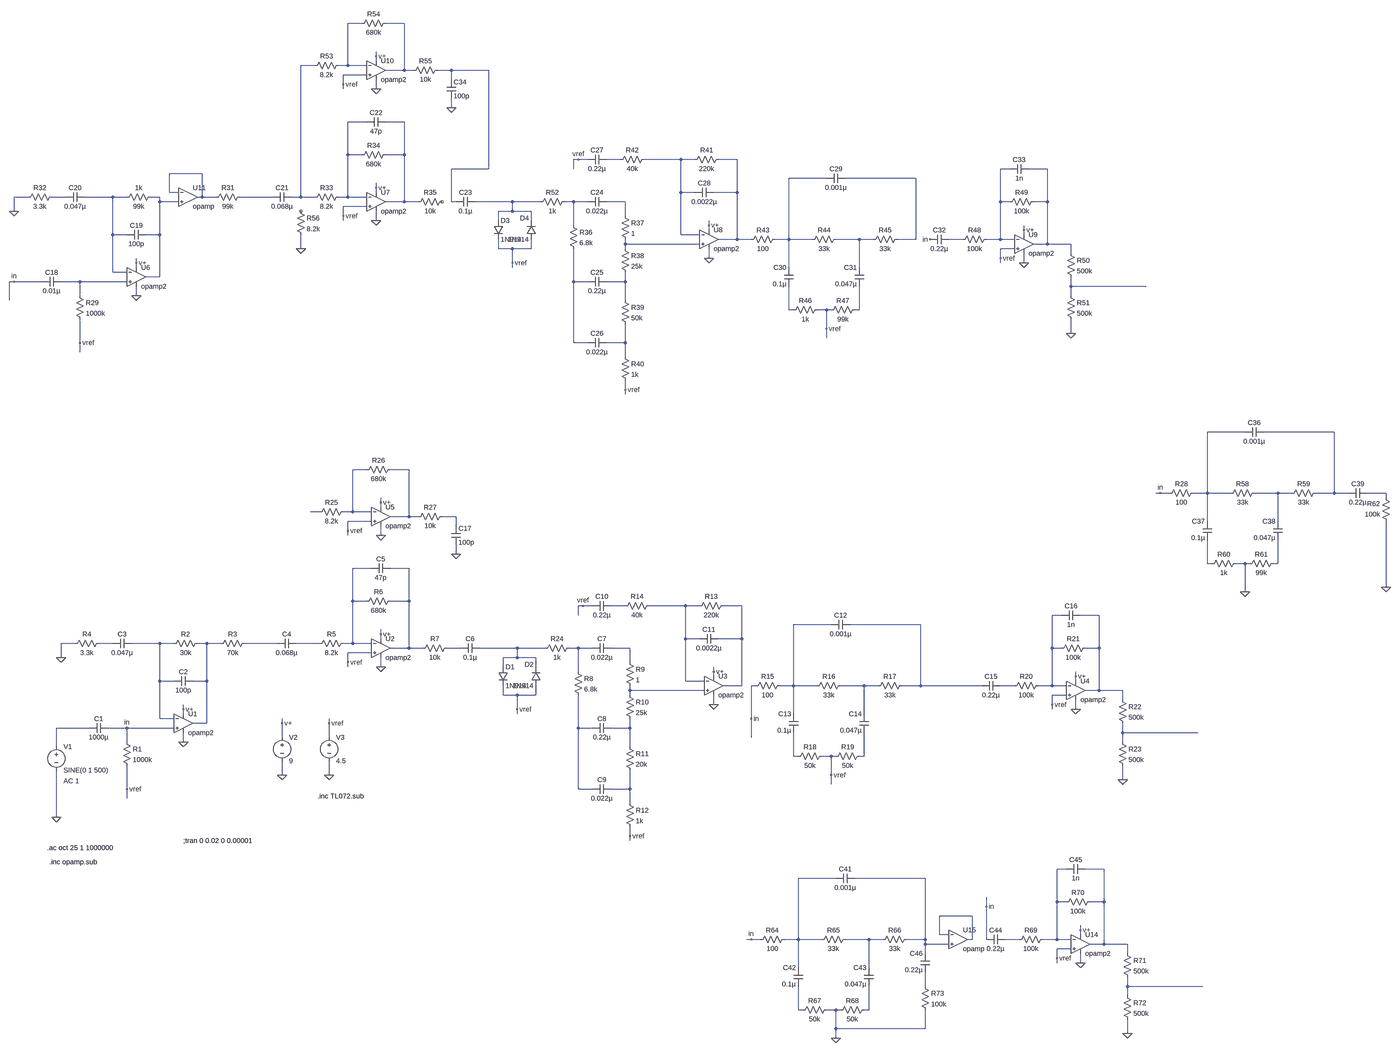
[diagram p0: schematic sMaster.asc, whole sheet]
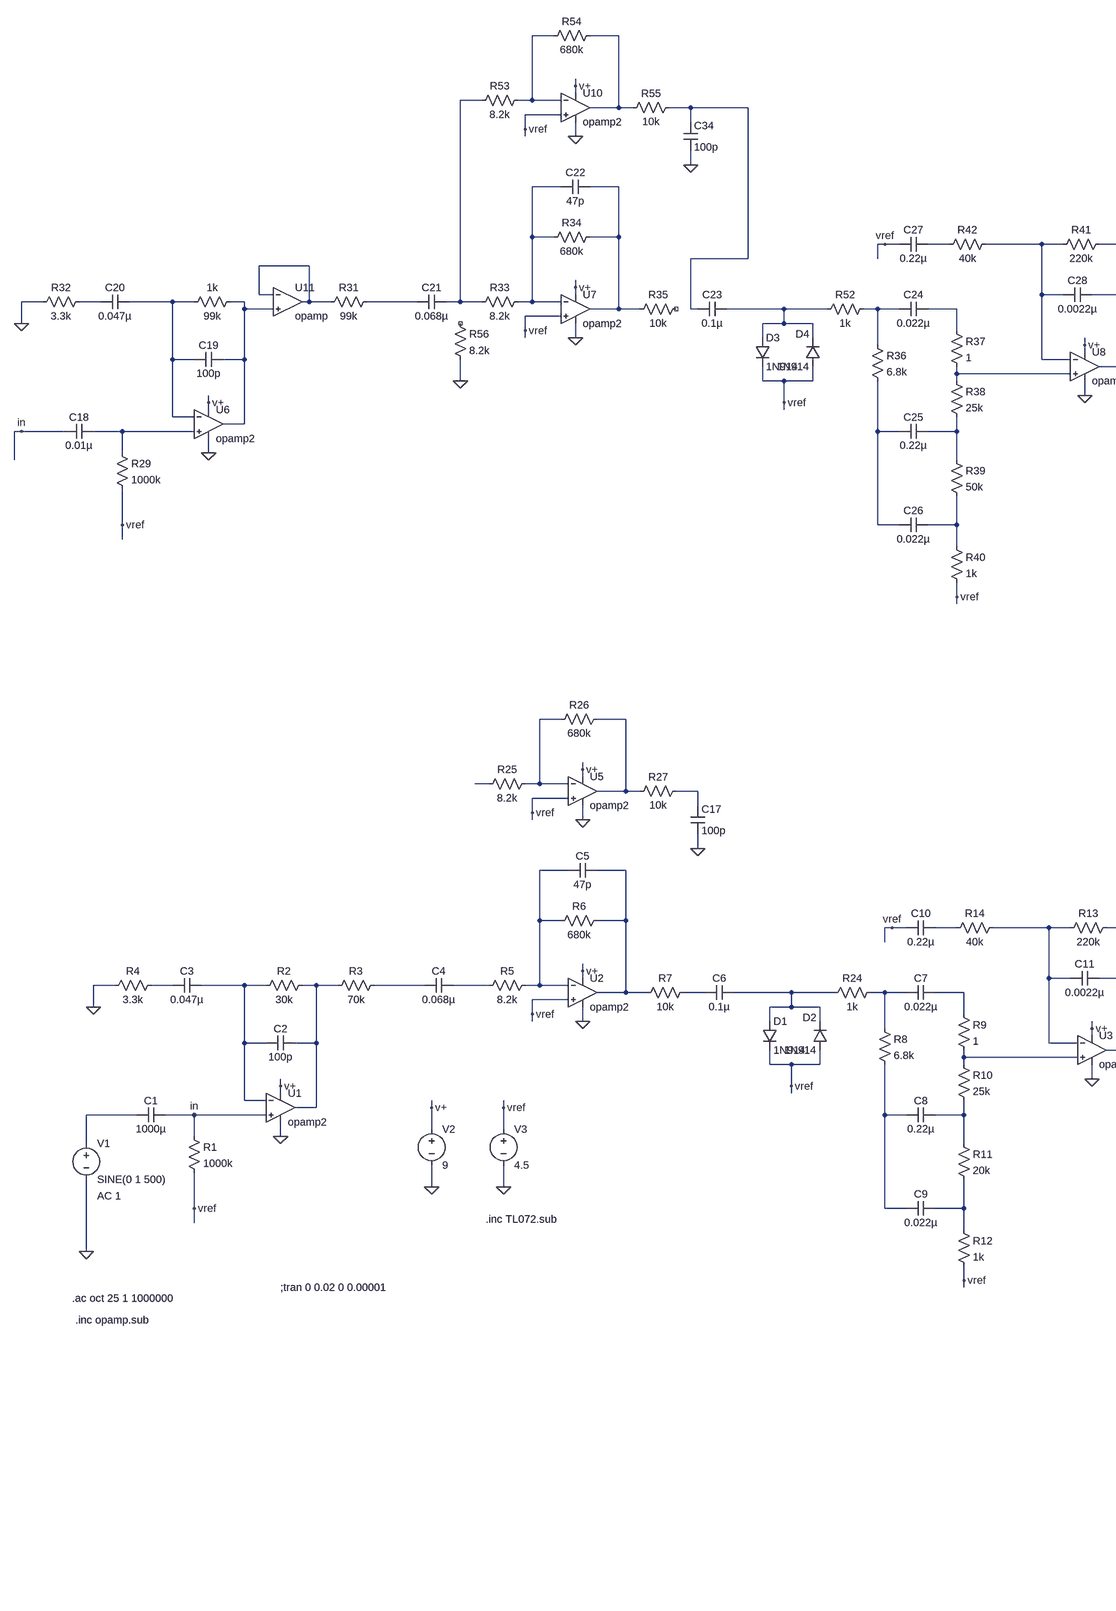
[diagram p1: schematic sMaster.asc, part, row 1 of 1, column 1 of 2]
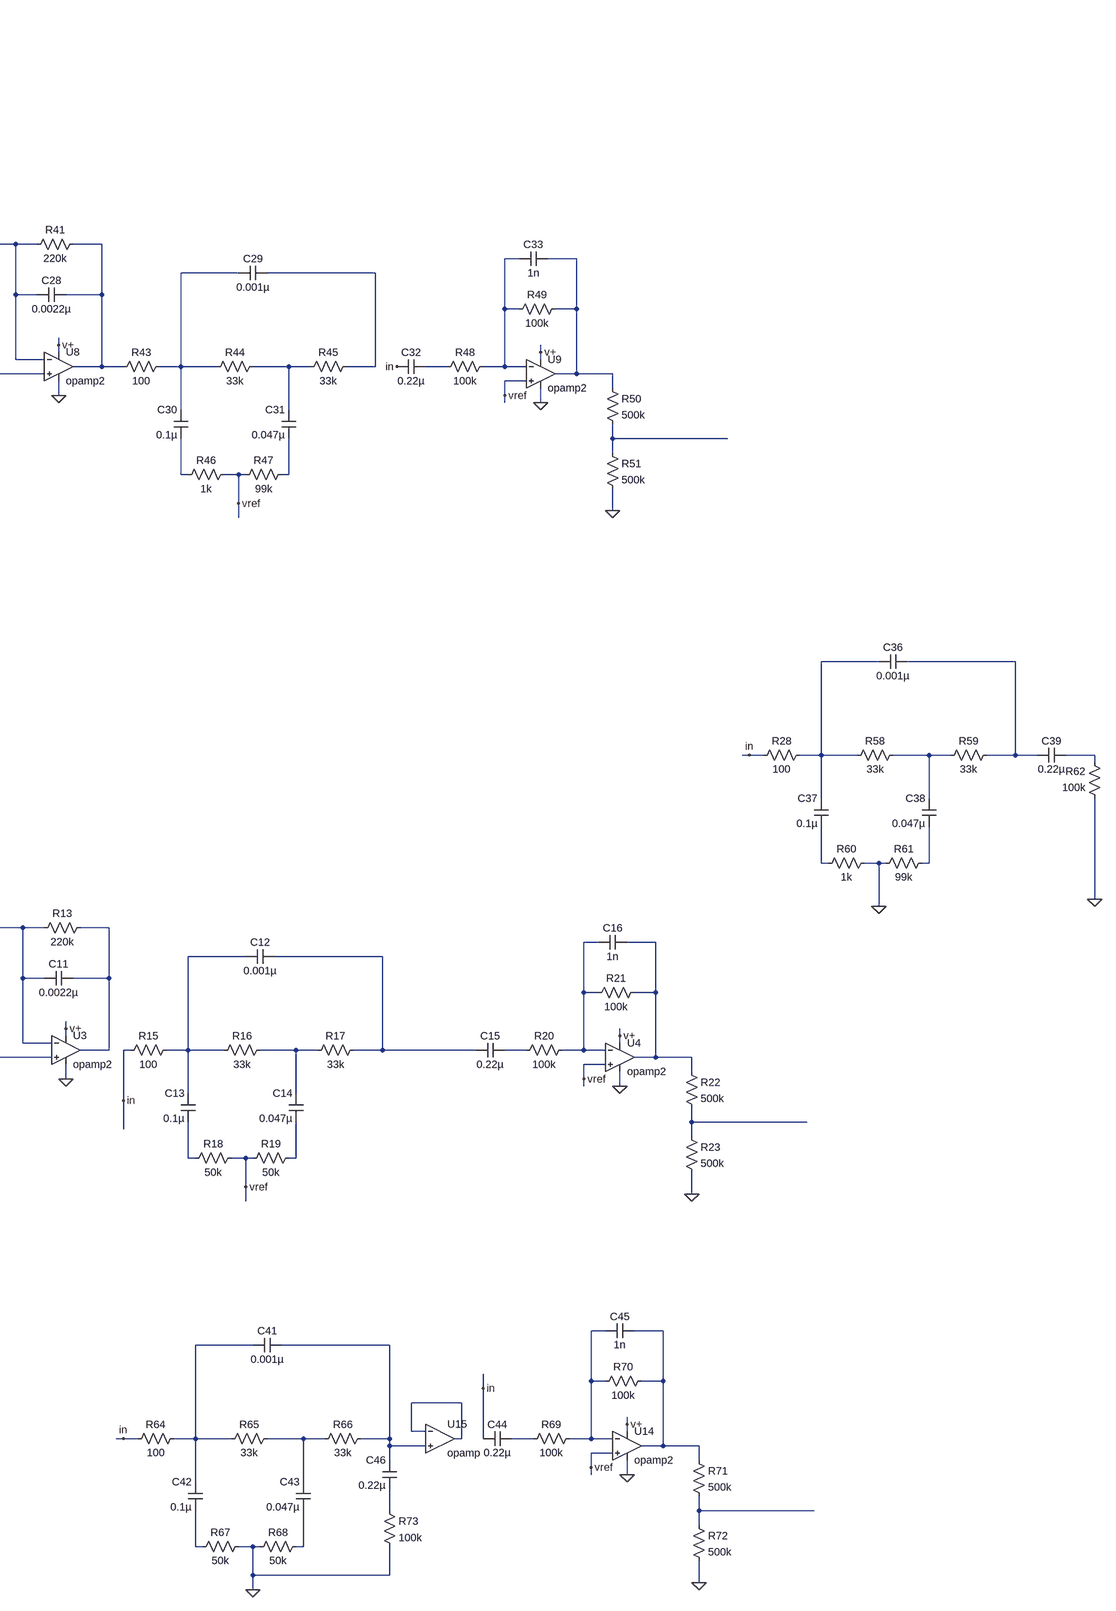
[diagram p2: schematic sMaster.asc, part, row 1 of 1, column 2 of 2]
sMaster.asc, the LTspice schematic file:
Version 4
SHEET 1 4708 1172
WIRE 1104 -2304 1056 -2304
WIRE 1248 -2304 1184 -2304
WIRE 1152 -2192 1152 -2208
WIRE 1152 -2176 1152 -2192
WIRE 944 -2160 896 -2160
WIRE 1056 -2160 1056 -2304
WIRE 1056 -2160 1024 -2160
WIRE 1120 -2160 1056 -2160
WIRE 1248 -2144 1248 -2304
WIRE 1248 -2144 1184 -2144
WIRE 1280 -2144 1248 -2144
WIRE 1408 -2144 1360 -2144
WIRE 1536 -2144 1408 -2144
WIRE 1120 -2128 1040 -2128
WIRE 1408 -2112 1408 -2144
WIRE 1040 -2096 1040 -2128
WIRE 1040 -2080 1040 -2096
WIRE 1152 -2080 1152 -2112
WIRE 1408 -2016 1408 -2048
WIRE 1120 -1968 1056 -1968
WIRE 1248 -1968 1184 -1968
WIRE 1056 -1856 1056 -1968
WIRE 1104 -1856 1056 -1856
WIRE 1248 -1856 1248 -1968
WIRE 1248 -1856 1184 -1856
WIRE 1840 -1840 1824 -1840
WIRE 1872 -1840 1840 -1840
WIRE 1984 -1840 1936 -1840
WIRE 2192 -1840 2064 -1840
WIRE 2240 -1840 2192 -1840
WIRE 2384 -1840 2320 -1840
WIRE 1536 -1808 1536 -2144
WIRE 1536 -1808 1408 -1808
WIRE 1824 -1808 1824 -1840
WIRE 3312 -1808 3280 -1808
WIRE 3440 -1808 3376 -1808
WIRE 560 -1792 448 -1792
WIRE 2688 -1776 2560 -1776
WIRE 2992 -1776 2752 -1776
WIRE 1152 -1744 1152 -1760
WIRE 448 -1728 448 -1792
WIRE 480 -1728 448 -1728
WIRE 1152 -1728 1152 -1744
WIRE 2192 -1728 2192 -1840
WIRE 2240 -1728 2192 -1728
WIRE 2384 -1728 2384 -1840
WIRE 2384 -1728 2304 -1728
WIRE -32 -1712 -80 -1712
WIRE 96 -1712 48 -1712
WIRE 256 -1712 160 -1712
WIRE 304 -1712 256 -1712
WIRE 416 -1712 384 -1712
WIRE 560 -1712 560 -1792
WIRE 560 -1712 544 -1712
WIRE 608 -1712 560 -1712
WIRE 800 -1712 688 -1712
WIRE 896 -1712 896 -2160
WIRE 896 -1712 864 -1712
WIRE 944 -1712 896 -1712
WIRE 1056 -1712 1056 -1856
WIRE 1056 -1712 1024 -1712
WIRE 1120 -1712 1056 -1712
WIRE 416 -1696 416 -1712
WIRE 480 -1696 416 -1696
WIRE 1248 -1696 1248 -1856
WIRE 1248 -1696 1184 -1696
WIRE 1296 -1696 1248 -1696
WIRE 1408 -1696 1408 -1808
WIRE 1424 -1696 1408 -1696
WIRE 1616 -1696 1488 -1696
WIRE 1712 -1696 1616 -1696
WIRE 1824 -1696 1792 -1696
WIRE 1872 -1696 1824 -1696
WIRE 2000 -1696 1936 -1696
WIRE 3280 -1696 3280 -1808
WIRE 3312 -1696 3280 -1696
WIRE 3440 -1696 3440 -1808
WIRE 3440 -1696 3392 -1696
WIRE 1120 -1680 1040 -1680
WIRE -80 -1664 -80 -1712
WIRE 1616 -1664 1616 -1696
WIRE 1616 -1664 1568 -1664
WIRE 1680 -1664 1616 -1664
WIRE 1040 -1648 1040 -1680
WIRE 2000 -1648 2000 -1696
WIRE 1040 -1632 1040 -1648
WIRE 1152 -1632 1152 -1664
WIRE 1568 -1632 1568 -1664
WIRE 1680 -1632 1680 -1664
WIRE 1824 -1616 1824 -1696
WIRE 2288 -1616 2288 -1632
WIRE 2288 -1600 2288 -1616
WIRE 3360 -1600 3360 -1616
WIRE 256 -1584 256 -1712
WIRE 304 -1584 256 -1584
WIRE 416 -1584 416 -1696
WIRE 416 -1584 368 -1584
WIRE 2192 -1584 2192 -1728
WIRE 2256 -1584 2192 -1584
WIRE 3360 -1584 3360 -1600
WIRE 2384 -1568 2384 -1728
WIRE 2384 -1568 2320 -1568
WIRE 2432 -1568 2384 -1568
WIRE 2560 -1568 2560 -1776
WIRE 2560 -1568 2512 -1568
WIRE 2640 -1568 2560 -1568
WIRE 2800 -1568 2720 -1568
WIRE 2848 -1568 2800 -1568
WIRE 2992 -1568 2992 -1776
WIRE 2992 -1568 2928 -1568
WIRE 3152 -1568 3104 -1568
WIRE 3280 -1568 3280 -1696
WIRE 3280 -1568 3232 -1568
WIRE 3328 -1568 3280 -1568
WIRE 2000 -1552 2000 -1568
WIRE 2256 -1552 2000 -1552
WIRE 3440 -1552 3440 -1696
WIRE 3440 -1552 3392 -1552
WIRE 3520 -1552 3440 -1552
WIRE 896 -1536 896 -1584
WIRE 1568 -1536 1568 -1568
WIRE 1616 -1536 1568 -1536
WIRE 1680 -1536 1680 -1568
WIRE 1680 -1536 1616 -1536
WIRE 2000 -1536 2000 -1552
WIRE 3328 -1536 3280 -1536
WIRE 3520 -1520 3520 -1552
WIRE 2288 -1504 2288 -1536
WIRE 3280 -1504 3280 -1536
WIRE 336 -1488 336 -1504
WIRE 1616 -1488 1616 -1536
WIRE 3280 -1488 3280 -1504
WIRE 3360 -1488 3360 -1520
WIRE 336 -1472 336 -1488
WIRE 1616 -1472 1616 -1488
WIRE 2560 -1472 2560 -1568
WIRE 2800 -1472 2800 -1568
WIRE 256 -1456 256 -1584
WIRE 304 -1456 256 -1456
WIRE 416 -1440 416 -1584
WIRE 416 -1440 368 -1440
WIRE -80 -1424 -96 -1424
WIRE 16 -1424 -80 -1424
WIRE 144 -1424 80 -1424
WIRE 304 -1424 144 -1424
WIRE 1824 -1424 1824 -1536
WIRE 1872 -1424 1824 -1424
WIRE 2000 -1424 2000 -1456
WIRE 2000 -1424 1936 -1424
WIRE 3520 -1408 3520 -1440
WIRE 3776 -1408 3520 -1408
WIRE 144 -1376 144 -1424
WIRE 336 -1376 336 -1408
WIRE 3520 -1376 3520 -1408
WIRE -96 -1360 -96 -1424
WIRE 2000 -1360 2000 -1424
WIRE 2560 -1328 2560 -1408
WIRE 2576 -1328 2560 -1328
WIRE 2688 -1328 2656 -1328
WIRE 2704 -1328 2688 -1328
WIRE 2800 -1328 2800 -1408
WIRE 2800 -1328 2784 -1328
WIRE 2688 -1264 2688 -1328
WIRE 3520 -1248 3520 -1296
WIRE 2688 -1232 2688 -1264
WIRE 144 -1216 144 -1296
WIRE 1824 -1216 1824 -1424
WIRE 1872 -1216 1824 -1216
WIRE 2000 -1216 2000 -1280
WIRE 2000 -1216 1936 -1216
WIRE 144 -1184 144 -1216
WIRE 2000 -1168 2000 -1216
WIRE 2000 -1056 2000 -1088
WIRE 2000 -1040 2000 -1056
WIRE 4112 -912 3984 -912
WIRE 4416 -912 4176 -912
WIRE 1120 -784 1072 -784
WIRE 1264 -784 1200 -784
WIRE 3824 -704 3808 -704
WIRE 3856 -704 3824 -704
WIRE 3984 -704 3984 -912
WIRE 3984 -704 3936 -704
WIRE 4064 -704 3984 -704
WIRE 4224 -704 4144 -704
WIRE 4272 -704 4224 -704
WIRE 4416 -704 4416 -912
WIRE 4416 -704 4352 -704
WIRE 4464 -704 4416 -704
WIRE 4592 -704 4528 -704
WIRE 4592 -688 4592 -704
WIRE 1168 -672 1168 -688
WIRE 1168 -656 1168 -672
WIRE 960 -640 928 -640
WIRE 1072 -640 1072 -784
WIRE 1072 -640 1040 -640
WIRE 1136 -640 1072 -640
WIRE 1264 -624 1264 -784
WIRE 1264 -624 1200 -624
WIRE 1296 -624 1264 -624
WIRE 1424 -624 1376 -624
WIRE 1136 -608 1056 -608
WIRE 3984 -608 3984 -704
WIRE 4224 -608 4224 -704
WIRE 1424 -592 1424 -624
WIRE 1056 -576 1056 -608
WIRE 1056 -560 1056 -576
WIRE 1168 -560 1168 -592
WIRE 1424 -496 1424 -528
WIRE 3984 -464 3984 -544
WIRE 4000 -464 3984 -464
WIRE 4112 -464 4080 -464
WIRE 4128 -464 4112 -464
WIRE 4224 -464 4224 -544
WIRE 4224 -464 4208 -464
WIRE 1136 -448 1072 -448
WIRE 1264 -448 1200 -448
WIRE 4592 -384 4592 -608
WIRE 4112 -368 4112 -464
WIRE 1072 -336 1072 -448
WIRE 1120 -336 1072 -336
WIRE 1264 -336 1264 -448
WIRE 1264 -336 1200 -336
WIRE 1856 -320 1840 -320
WIRE 1888 -320 1856 -320
WIRE 2000 -320 1952 -320
WIRE 2208 -320 2080 -320
WIRE 2256 -320 2208 -320
WIRE 2400 -320 2336 -320
WIRE 1840 -288 1840 -320
WIRE 3488 -288 3456 -288
WIRE 3616 -288 3552 -288
WIRE 2704 -256 2576 -256
WIRE 3008 -256 2768 -256
WIRE 1168 -224 1168 -240
WIRE 1168 -208 1168 -224
WIRE 2208 -208 2208 -320
WIRE 2256 -208 2208 -208
WIRE 2400 -208 2400 -320
WIRE 2400 -208 2320 -208
WIRE 128 -192 80 -192
WIRE 256 -192 208 -192
WIRE 416 -192 320 -192
WIRE 464 -192 416 -192
WIRE 576 -192 544 -192
WIRE 624 -192 576 -192
WIRE 816 -192 704 -192
WIRE 960 -192 880 -192
WIRE 1072 -192 1072 -336
WIRE 1072 -192 1040 -192
WIRE 1136 -192 1072 -192
WIRE 1264 -176 1264 -336
WIRE 1264 -176 1200 -176
WIRE 1312 -176 1264 -176
WIRE 1440 -176 1392 -176
WIRE 1632 -176 1504 -176
WIRE 1728 -176 1632 -176
WIRE 1840 -176 1808 -176
WIRE 1888 -176 1840 -176
WIRE 2016 -176 1952 -176
WIRE 3456 -176 3456 -288
WIRE 3488 -176 3456 -176
WIRE 3616 -176 3616 -288
WIRE 3616 -176 3568 -176
WIRE 1136 -160 1056 -160
WIRE 80 -144 80 -192
WIRE 1632 -144 1632 -176
WIRE 1632 -144 1584 -144
WIRE 1696 -144 1632 -144
WIRE 1056 -128 1056 -160
WIRE 2016 -128 2016 -176
WIRE 1056 -112 1056 -128
WIRE 1168 -112 1168 -144
WIRE 1584 -112 1584 -144
WIRE 1696 -112 1696 -144
WIRE 1840 -96 1840 -176
WIRE 2304 -96 2304 -112
WIRE 2304 -80 2304 -96
WIRE 3536 -80 3536 -96
WIRE 416 -64 416 -192
WIRE 464 -64 416 -64
WIRE 576 -64 576 -192
WIRE 576 -64 528 -64
WIRE 2208 -64 2208 -208
WIRE 2272 -64 2208 -64
WIRE 3536 -64 3536 -80
WIRE 2400 -48 2400 -208
WIRE 2400 -48 2336 -48
WIRE 2448 -48 2432 -48
WIRE 2576 -48 2576 -256
WIRE 2576 -48 2528 -48
WIRE 2656 -48 2576 -48
WIRE 2816 -48 2736 -48
WIRE 2864 -48 2816 -48
WIRE 3008 -48 3008 -256
WIRE 3008 -48 2944 -48
WIRE 3216 -48 3008 -48
WIRE 3328 -48 3280 -48
WIRE 3456 -48 3456 -176
WIRE 3456 -48 3408 -48
WIRE 3504 -48 3456 -48
WIRE 2016 -32 2016 -48
WIRE 2272 -32 2016 -32
WIRE 3616 -32 3616 -176
WIRE 3616 -32 3568 -32
WIRE 3696 -32 3616 -32
WIRE 1584 -16 1584 -48
WIRE 1632 -16 1584 -16
WIRE 1696 -16 1696 -48
WIRE 1696 -16 1632 -16
WIRE 2016 -16 2016 -32
WIRE 3504 -16 3456 -16
WIRE 3696 0 3696 -32
WIRE 2304 16 2304 -16
WIRE 3456 16 3456 -16
WIRE 496 32 496 16
WIRE 1632 32 1632 -16
WIRE 3456 32 3456 16
WIRE 3536 32 3536 0
WIRE 496 48 496 32
WIRE 1632 48 1632 32
WIRE 2576 48 2576 -48
WIRE 2816 48 2816 -48
WIRE 416 64 416 -64
WIRE 464 64 416 64
WIRE 2432 64 2432 -48
WIRE 576 80 576 -64
WIRE 576 80 528 80
WIRE 832 80 832 64
WIRE 992 80 992 64
WIRE 176 96 64 96
WIRE 304 96 240 96
WIRE 464 96 304 96
WIRE 1840 96 1840 -16
WIRE 1888 96 1840 96
WIRE 2016 96 2016 64
WIRE 2016 96 1952 96
WIRE 3696 112 3696 80
WIRE 3952 112 3696 112
WIRE 832 128 832 80
WIRE 992 128 992 80
WIRE 2432 128 2432 64
WIRE 304 144 304 96
WIRE 496 144 496 112
WIRE 3696 144 3696 112
WIRE 64 160 64 96
WIRE 2016 160 2016 96
WIRE 2576 192 2576 112
WIRE 2592 192 2576 192
WIRE 2704 192 2672 192
WIRE 2720 192 2704 192
WIRE 2816 192 2816 112
WIRE 2816 192 2800 192
WIRE 832 256 832 208
WIRE 992 256 992 208
WIRE 2704 256 2704 192
WIRE 3696 272 3696 224
WIRE 2704 288 2704 256
WIRE 304 304 304 224
WIRE 1840 304 1840 96
WIRE 1888 304 1840 304
WIRE 2016 304 2016 240
WIRE 2016 304 1952 304
WIRE 304 336 304 304
WIRE 2016 352 2016 304
WIRE 64 400 64 240
WIRE 2016 464 2016 432
WIRE 2016 480 2016 464
WIRE 3504 576 3472 576
WIRE 3632 576 3568 576
WIRE 2720 608 2592 608
WIRE 3024 608 2784 608
WIRE 3472 688 3472 576
WIRE 3504 688 3472 688
WIRE 3632 688 3632 576
WIRE 3632 688 3584 688
WIRE 3232 704 3232 672
WIRE 3184 736 3072 736
WIRE 3552 784 3552 768
WIRE 3072 800 3072 736
WIRE 3104 800 3072 800
WIRE 3552 800 3552 784
WIRE 2432 816 2416 816
WIRE 2464 816 2432 816
WIRE 2592 816 2592 608
WIRE 2592 816 2544 816
WIRE 2672 816 2592 816
WIRE 2832 816 2752 816
WIRE 2880 816 2832 816
WIRE 3024 816 3024 608
WIRE 3024 816 2960 816
WIRE 3184 816 3184 736
WIRE 3184 816 3168 816
WIRE 3232 816 3232 704
WIRE 3344 816 3296 816
WIRE 3472 816 3472 688
WIRE 3472 816 3424 816
WIRE 3520 816 3472 816
WIRE 3024 832 3024 816
WIRE 3104 832 3024 832
WIRE 3632 832 3632 688
WIRE 3632 832 3584 832
WIRE 3712 832 3632 832
WIRE 3520 848 3472 848
WIRE 3024 864 3024 832
WIRE 3712 864 3712 832
WIRE 3472 880 3472 848
WIRE 3472 896 3472 880
WIRE 3552 896 3552 864
WIRE 2592 912 2592 816
WIRE 2832 912 2832 816
WIRE 3024 976 3024 928
WIRE 3712 976 3712 944
WIRE 3968 976 3712 976
WIRE 3712 1008 3712 976
WIRE 2592 1056 2592 976
WIRE 2608 1056 2592 1056
WIRE 2720 1056 2688 1056
WIRE 2736 1056 2720 1056
WIRE 2832 1056 2832 976
WIRE 2832 1056 2816 1056
WIRE 2720 1120 2720 1056
WIRE 3024 1120 3024 1056
WIRE 3024 1120 2720 1120
WIRE 3712 1136 3712 1088
WIRE 2720 1152 2720 1120
FLAG 80 -144 0
FLAG 3696 272 0
FLAG 64 400 0
FLAG 496 144 0
FLAG 496 32 v+
FLAG 832 256 0
FLAG 832 80 v+
FLAG 1168 -112 0
FLAG 1168 -224 v+
FLAG 2304 16 0
FLAG 2304 -96 v+
FLAG 3536 32 0
FLAG 3536 -80 v+
FLAG 992 256 0
FLAG 992 80 vref
FLAG 304 304 vref
FLAG 1056 -128 vref
FLAG 1632 32 vref
FLAG 2016 464 vref
FLAG 1856 -320 vref
FLAG 2704 256 vref
FLAG 3456 16 vref
FLAG 1168 -560 0
FLAG 1168 -672 v+
FLAG 1056 -576 vref
FLAG 1424 -496 0
FLAG -80 -1664 0
FLAG 3520 -1248 0
FLAG -80 -1424 in
FLAG 336 -1376 0
FLAG 336 -1488 v+
FLAG 1152 -1632 0
FLAG 1152 -1744 v+
FLAG 2288 -1504 0
FLAG 2288 -1616 v+
FLAG 3360 -1488 0
FLAG 3360 -1600 v+
FLAG 144 -1216 vref
FLAG 1040 -1648 vref
FLAG 1616 -1488 vref
FLAG 2000 -1056 vref
FLAG 1840 -1840 vref
FLAG 2688 -1264 vref
FLAG 3280 -1504 vref
FLAG 1152 -2080 0
FLAG 1152 -2192 v+
FLAG 1040 -2096 vref
FLAG 1408 -2016 0
FLAG 896 -1536 0
FLAG 3040 -1568 in
FLAG 3824 -704 in
FLAG 4112 -368 0
FLAG 4592 -384 0
FLAG 3712 1136 0
FLAG 3552 896 0
FLAG 3552 784 v+
FLAG 3472 880 vref
FLAG 2432 816 in
FLAG 3232 704 in
FLAG 2720 1152 0
FLAG 304 96 in
FLAG 2432 64 in
SYMBOL voltage 64 144 R0
WINDOW 123 24 132 Left 0
WINDOW 39 0 0 Left 0
SYMATTR Value2 AC 1
SYMATTR InstName V1
SYMATTR Value SINE(0 1 500)
SYMBOL res 288 128 R0
SYMATTR InstName R1
SYMATTR Value 1000k
SYMBOL cap 528 -80 R90
WINDOW 0 0 32 VBottom 0
WINDOW 3 32 32 VTop 0
SYMATTR InstName C2
SYMATTR Value 100p
SYMBOL res 560 -208 R90
WINDOW 0 0 56 VBottom 0
WINDOW 3 32 56 VTop 0
SYMATTR InstName R2
SYMATTR Value 30k
SYMBOL res 720 -208 R90
WINDOW 0 0 56 VBottom 0
WINDOW 3 32 56 VTop 0
SYMATTR InstName R3
SYMATTR Value 70k
SYMBOL res 224 -208 R90
WINDOW 0 0 56 VBottom 0
WINDOW 3 32 56 VTop 0
SYMATTR InstName R4
SYMATTR Value 3.3k
SYMBOL cap 320 -208 R90
WINDOW 0 0 32 VBottom 0
WINDOW 3 32 32 VTop 0
SYMATTR InstName C3
SYMATTR Value 0.047µ
SYMBOL cap 880 -208 R90
WINDOW 0 0 32 VBottom 0
WINDOW 3 32 32 VTop 0
SYMATTR InstName C4
SYMATTR Value 0.068µ
SYMBOL res 1056 -208 R90
WINDOW 0 0 56 VBottom 0
WINDOW 3 32 56 VTop 0
SYMATTR InstName R5
SYMATTR Value 8.2k
SYMBOL res 1216 -352 R90
WINDOW 0 0 56 VBottom 0
WINDOW 3 32 56 VTop 0
SYMATTR InstName R6
SYMATTR Value 680k
SYMBOL cap 1200 -464 R90
WINDOW 0 0 32 VBottom 0
WINDOW 3 32 32 VTop 0
SYMATTR InstName C5
SYMATTR Value 47p
SYMBOL res 1408 -192 R90
WINDOW 0 0 56 VBottom 0
WINDOW 3 32 56 VTop 0
SYMATTR InstName R7
SYMATTR Value 10k
SYMBOL cap 1504 -192 R90
WINDOW 0 0 32 VBottom 0
WINDOW 3 32 32 VTop 0
SYMATTR InstName C6
SYMATTR Value 0.1µ
SYMBOL diode 1568 -112 R0
SYMATTR InstName D1
SYMATTR Value 1N914
SYMBOL diode 1712 -48 R180
WINDOW 0 24 72 Left 0
WINDOW 3 24 0 Left 0
SYMATTR InstName D2
SYMATTR Value 1N914
SYMBOL cap 1952 -192 R90
WINDOW 0 0 32 VBottom 0
WINDOW 3 32 32 VTop 0
SYMATTR InstName C7
SYMATTR Value 0.022µ
SYMBOL cap 1952 80 R90
WINDOW 0 0 32 VBottom 0
WINDOW 3 32 32 VTop 0
SYMATTR InstName C8
SYMATTR Value 0.22µ
SYMBOL cap 1952 288 R90
WINDOW 0 0 32 VBottom 0
WINDOW 3 32 32 VTop 0
SYMATTR InstName C9
SYMATTR Value 0.022µ
SYMBOL res 1824 -112 R0
SYMATTR InstName R8
SYMATTR Value 6.8k
SYMBOL res 2000 -144 R0
SYMATTR InstName R9
SYMATTR Value 1
SYMBOL res 2000 -32 R0
SYMATTR InstName R10
SYMATTR Value 25k
SYMBOL res 2000 144 R0
SYMATTR InstName R11
SYMATTR Value 20k
SYMBOL res 2000 336 R0
SYMATTR InstName R12
SYMATTR Value 1k
SYMBOL res 2352 -336 R90
WINDOW 0 0 56 VBottom 0
WINDOW 3 32 56 VTop 0
SYMATTR InstName R13
SYMATTR Value 220k
SYMBOL res 2096 -336 R90
WINDOW 0 0 56 VBottom 0
WINDOW 3 32 56 VTop 0
SYMATTR InstName R14
SYMATTR Value 40k
SYMBOL cap 1952 -336 R90
WINDOW 0 0 32 VBottom 0
WINDOW 3 32 32 VTop 0
SYMATTR InstName C10
SYMATTR Value 0.22µ
SYMBOL cap 2320 -224 R90
WINDOW 0 0 32 VBottom 0
WINDOW 3 32 32 VTop 0
SYMATTR InstName C11
SYMATTR Value 0.0022µ
SYMBOL res 2544 -64 R90
WINDOW 0 0 56 VBottom 0
WINDOW 3 32 56 VTop 0
SYMATTR InstName R15
SYMATTR Value 100
SYMBOL res 2752 -64 R90
WINDOW 0 0 56 VBottom 0
WINDOW 3 32 56 VTop 0
SYMATTR InstName R16
SYMATTR Value 33k
SYMBOL res 2960 -64 R90
WINDOW 0 0 56 VBottom 0
WINDOW 3 32 56 VTop 0
SYMATTR InstName R17
SYMATTR Value 33k
SYMBOL cap 2768 -272 R90
WINDOW 0 0 32 VBottom 0
WINDOW 3 32 32 VTop 0
SYMATTR InstName C12
SYMATTR Value 0.001µ
SYMBOL cap 2592 112 R180
WINDOW 0 24 64 Left 0
WINDOW 3 24 8 Left 0
SYMATTR InstName C13
SYMATTR Value 0.1µ
SYMBOL cap 2832 112 R180
WINDOW 0 24 64 Left 0
WINDOW 3 24 8 Left 0
SYMATTR InstName C14
SYMATTR Value 0.047µ
SYMBOL res 2688 176 R90
WINDOW 0 0 56 VBottom 0
WINDOW 3 32 56 VTop 0
SYMATTR InstName R18
SYMATTR Value 50k
SYMBOL res 2816 176 R90
WINDOW 0 0 56 VBottom 0
WINDOW 3 32 56 VTop 0
SYMATTR InstName R19
SYMATTR Value 50k
SYMBOL res 3424 -64 R90
WINDOW 0 0 56 VBottom 0
WINDOW 3 32 56 VTop 0
SYMATTR InstName R20
SYMATTR Value 100k
SYMBOL cap 3280 -64 R90
WINDOW 0 0 32 VBottom 0
WINDOW 3 32 32 VTop 0
SYMATTR InstName C15
SYMATTR Value 0.22µ
SYMBOL res 3584 -192 R90
WINDOW 0 0 56 VBottom 0
WINDOW 3 32 56 VTop 0
SYMATTR InstName R21
SYMATTR Value 100k
SYMBOL cap 3552 -304 R90
WINDOW 0 0 32 VBottom 0
WINDOW 3 32 32 VTop 0
SYMATTR InstName C16
SYMATTR Value 1n
SYMBOL res 3680 -16 R0
SYMATTR InstName R22
SYMATTR Value 500k
SYMBOL res 3680 128 R0
SYMATTR InstName R23
SYMATTR Value 500k
SYMBOL res 1824 -192 R90
WINDOW 0 0 56 VBottom 0
WINDOW 3 32 56 VTop 0
SYMATTR InstName R24
SYMATTR Value 1k
SYMBOL Opamps\\opamp2 496 16 R0
SYMATTR InstName U1
SYMBOL voltage 832 112 R0
WINDOW 123 24 132 Left 0
WINDOW 39 0 0 Left 0
SYMATTR InstName V2
SYMATTR Value 9
SYMBOL Opamps\\opamp2 1168 -240 R0
SYMATTR InstName U2
SYMBOL Opamps\\opamp2 2304 -112 R0
SYMATTR InstName U3
SYMBOL Opamps\\opamp2 3536 -96 R0
SYMATTR InstName U4
SYMBOL voltage 992 112 R0
WINDOW 123 24 132 Left 0
WINDOW 39 0 0 Left 0
SYMATTR InstName V3
SYMATTR Value 4.5
SYMBOL res 1056 -656 R90
WINDOW 0 0 56 VBottom 0
WINDOW 3 32 56 VTop 0
SYMATTR InstName R25
SYMATTR Value 8.2k
SYMBOL res 1216 -800 R90
WINDOW 0 0 56 VBottom 0
WINDOW 3 32 56 VTop 0
SYMATTR InstName R26
SYMATTR Value 680k
SYMBOL Opamps\\opamp2 1168 -688 R0
SYMATTR InstName U5
SYMBOL res 1392 -640 R90
WINDOW 0 0 56 VBottom 0
WINDOW 3 32 56 VTop 0
SYMATTR InstName R27
SYMATTR Value 10k
SYMBOL cap 1408 -592 R0
SYMATTR InstName C17
SYMATTR Value 100p
SYMBOL cap 80 -1440 R90
WINDOW 0 0 32 VBottom 0
WINDOW 3 32 32 VTop 0
SYMATTR InstName C18
SYMATTR Value 0.01µ
SYMBOL res 128 -1392 R0
SYMATTR InstName R29
SYMATTR Value 1000k
SYMBOL cap 368 -1600 R90
WINDOW 0 0 32 VBottom 0
WINDOW 3 32 32 VTop 0
SYMATTR InstName C19
SYMATTR Value 100p
SYMBOL res 400 -1728 R90
WINDOW 0 0 56 VBottom 0
WINDOW 3 32 56 VTop 0
SYMATTR InstName 1k
SYMATTR Value 99k
SYMBOL res 704 -1728 R90
WINDOW 0 0 56 VBottom 0
WINDOW 3 32 56 VTop 0
SYMATTR InstName R31
SYMATTR Value 99k
SYMBOL res 64 -1728 R90
WINDOW 0 0 56 VBottom 0
WINDOW 3 32 56 VTop 0
SYMATTR InstName R32
SYMATTR Value 3.3k
SYMBOL cap 160 -1728 R90
WINDOW 0 0 32 VBottom 0
WINDOW 3 32 32 VTop 0
SYMATTR InstName C20
SYMATTR Value 0.047µ
SYMBOL cap 864 -1728 R90
WINDOW 0 0 32 VBottom 0
WINDOW 3 32 32 VTop 0
SYMATTR InstName C21
SYMATTR Value 0.068µ
SYMBOL res 1040 -1728 R90
WINDOW 0 0 56 VBottom 0
WINDOW 3 32 56 VTop 0
SYMATTR InstName R33
SYMATTR Value 8.2k
SYMBOL res 1200 -1872 R90
WINDOW 0 0 56 VBottom 0
WINDOW 3 32 56 VTop 0
SYMATTR InstName R34
SYMATTR Value 680k
SYMBOL cap 1184 -1984 R90
WINDOW 0 0 32 VBottom 0
WINDOW 3 32 32 VTop 0
SYMATTR InstName C22
SYMATTR Value 47p
SYMBOL res 1392 -1712 R90
WINDOW 0 0 56 VBottom 0
WINDOW 3 32 56 VTop 0
SYMATTR InstName R35
SYMATTR Value 10k
SYMBOL cap 1488 -1712 R90
WINDOW 0 0 32 VBottom 0
WINDOW 3 32 32 VTop 0
SYMATTR InstName C23
SYMATTR Value 0.1µ
SYMBOL diode 1552 -1632 R0
SYMATTR InstName D3
SYMATTR Value 1N914
SYMBOL diode 1696 -1568 R180
WINDOW 0 24 72 Left 0
WINDOW 3 24 0 Left 0
SYMATTR InstName D4
SYMATTR Value 1N914
SYMBOL cap 1936 -1712 R90
WINDOW 0 0 32 VBottom 0
WINDOW 3 32 32 VTop 0
SYMATTR InstName C24
SYMATTR Value 0.022µ
SYMBOL cap 1936 -1440 R90
WINDOW 0 0 32 VBottom 0
WINDOW 3 32 32 VTop 0
SYMATTR InstName C25
SYMATTR Value 0.22µ
SYMBOL cap 1936 -1232 R90
WINDOW 0 0 32 VBottom 0
WINDOW 3 32 32 VTop 0
SYMATTR InstName C26
SYMATTR Value 0.022µ
SYMBOL res 1808 -1632 R0
SYMATTR InstName R36
SYMATTR Value 6.8k
SYMBOL res 1984 -1664 R0
SYMATTR InstName R37
SYMATTR Value 1
SYMBOL res 1984 -1552 R0
SYMATTR InstName R38
SYMATTR Value 25k
SYMBOL res 1984 -1376 R0
SYMATTR InstName R39
SYMATTR Value 50k
SYMBOL res 1984 -1184 R0
SYMATTR InstName R40
SYMATTR Value 1k
SYMBOL res 2336 -1856 R90
WINDOW 0 0 56 VBottom 0
WINDOW 3 32 56 VTop 0
SYMATTR InstName R41
SYMATTR Value 220k
SYMBOL res 2080 -1856 R90
WINDOW 0 0 56 VBottom 0
WINDOW 3 32 56 VTop 0
SYMATTR InstName R42
SYMATTR Value 40k
SYMBOL cap 1936 -1856 R90
WINDOW 0 0 32 VBottom 0
WINDOW 3 32 32 VTop 0
SYMATTR InstName C27
SYMATTR Value 0.22µ
SYMBOL cap 2304 -1744 R90
WINDOW 0 0 32 VBottom 0
WINDOW 3 32 32 VTop 0
SYMATTR InstName C28
SYMATTR Value 0.0022µ
SYMBOL res 2528 -1584 R90
WINDOW 0 0 56 VBottom 0
WINDOW 3 32 56 VTop 0
SYMATTR InstName R43
SYMATTR Value 100
SYMBOL res 2736 -1584 R90
WINDOW 0 0 56 VBottom 0
WINDOW 3 32 56 VTop 0
SYMATTR InstName R44
SYMATTR Value 33k
SYMBOL res 2944 -1584 R90
WINDOW 0 0 56 VBottom 0
WINDOW 3 32 56 VTop 0
SYMATTR InstName R45
SYMATTR Value 33k
SYMBOL cap 2752 -1792 R90
WINDOW 0 0 32 VBottom 0
WINDOW 3 32 32 VTop 0
SYMATTR InstName C29
SYMATTR Value 0.001µ
SYMBOL cap 2576 -1408 R180
WINDOW 0 24 64 Left 0
WINDOW 3 24 8 Left 0
SYMATTR InstName C30
SYMATTR Value 0.1µ
SYMBOL cap 2816 -1408 R180
WINDOW 0 24 64 Left 0
WINDOW 3 24 8 Left 0
SYMATTR InstName C31
SYMATTR Value 0.047µ
SYMBOL res 2672 -1344 R90
WINDOW 0 0 56 VBottom 0
WINDOW 3 32 56 VTop 0
SYMATTR InstName R46
SYMATTR Value 1k
SYMBOL res 2800 -1344 R90
WINDOW 0 0 56 VBottom 0
WINDOW 3 32 56 VTop 0
SYMATTR InstName R47
SYMATTR Value 99k
SYMBOL res 3248 -1584 R90
WINDOW 0 0 56 VBottom 0
WINDOW 3 32 56 VTop 0
SYMATTR InstName R48
SYMATTR Value 100k
SYMBOL cap 3104 -1584 R90
WINDOW 0 0 32 VBottom 0
WINDOW 3 32 32 VTop 0
SYMATTR InstName C32
SYMATTR Value 0.22µ
SYMBOL res 3408 -1712 R90
WINDOW 0 0 56 VBottom 0
WINDOW 3 32 56 VTop 0
SYMATTR InstName R49
SYMATTR Value 100k
SYMBOL cap 3376 -1824 R90
WINDOW 0 0 32 VBottom 0
WINDOW 3 32 32 VTop 0
SYMATTR InstName C33
SYMATTR Value 1n
SYMBOL res 3504 -1536 R0
SYMATTR InstName R50
SYMATTR Value 500k
SYMBOL res 3504 -1392 R0
SYMATTR InstName R51
SYMATTR Value 500k
SYMBOL res 1808 -1712 R90
WINDOW 0 0 56 VBottom 0
WINDOW 3 32 56 VTop 0
SYMATTR InstName R52
SYMATTR Value 1k
SYMBOL Opamps\\opamp2 336 -1504 R0
SYMATTR InstName U6
SYMBOL Opamps\\opamp2 1152 -1760 R0
SYMATTR InstName U7
SYMBOL Opamps\\opamp2 2288 -1632 R0
SYMATTR InstName U8
SYMBOL Opamps\\opamp2 3360 -1616 R0
SYMATTR InstName U9
SYMBOL res 1040 -2176 R90
WINDOW 0 0 56 VBottom 0
WINDOW 3 32 56 VTop 0
SYMATTR InstName R53
SYMATTR Value 8.2k
SYMBOL res 1200 -2320 R90
WINDOW 0 0 56 VBottom 0
WINDOW 3 32 56 VTop 0
SYMATTR InstName R54
SYMATTR Value 680k
SYMBOL Opamps\\opamp2 1152 -2208 R0
SYMATTR InstName U10
SYMBOL res 1376 -2160 R90
WINDOW 0 0 56 VBottom 0
WINDOW 3 32 56 VTop 0
SYMATTR InstName R55
SYMATTR Value 10k
SYMBOL cap 1392 -2112 R0
SYMATTR InstName C34
SYMATTR Value 100p
SYMBOL res 880 -1680 R0
SYMATTR InstName R56
SYMATTR Value 8.2k
SYMBOL Opamps\\opamp 512 -1776 R0
SYMATTR InstName U11
SYMBOL res 3952 -720 R90
WINDOW 0 0 56 VBottom 0
WINDOW 3 32 56 VTop 0
SYMATTR InstName R28
SYMATTR Value 100
SYMBOL res 4160 -720 R90
WINDOW 0 0 56 VBottom 0
WINDOW 3 32 56 VTop 0
SYMATTR InstName R58
SYMATTR Value 33k
SYMBOL res 4368 -720 R90
WINDOW 0 0 56 VBottom 0
WINDOW 3 32 56 VTop 0
SYMATTR InstName R59
SYMATTR Value 33k
SYMBOL cap 4176 -928 R90
WINDOW 0 0 32 VBottom 0
WINDOW 3 32 32 VTop 0
SYMATTR InstName C36
SYMATTR Value 0.001µ
SYMBOL cap 4000 -544 R180
WINDOW 0 24 64 Left 0
WINDOW 3 24 8 Left 0
SYMATTR InstName C37
SYMATTR Value 0.1µ
SYMBOL cap 4240 -544 R180
WINDOW 0 24 64 Left 0
WINDOW 3 24 8 Left 0
SYMATTR InstName C38
SYMATTR Value 0.047µ
SYMBOL res 4096 -480 R90
WINDOW 0 0 56 VBottom 0
WINDOW 3 32 56 VTop 0
SYMATTR InstName R60
SYMATTR Value 1k
SYMBOL res 4224 -480 R90
WINDOW 0 0 56 VBottom 0
WINDOW 3 32 56 VTop 0
SYMATTR InstName R61
SYMATTR Value 99k
SYMBOL res 4608 -592 R180
WINDOW 0 36 76 Left 0
WINDOW 3 36 40 Left 0
SYMATTR InstName R62
SYMATTR Value 100k
SYMBOL cap 4528 -720 R90
WINDOW 0 0 32 VBottom 0
WINDOW 3 32 32 VTop 0
SYMATTR InstName C39
SYMATTR Value 0.22µ
SYMBOL res 2560 800 R90
WINDOW 0 0 56 VBottom 0
WINDOW 3 32 56 VTop 0
SYMATTR InstName R64
SYMATTR Value 100
SYMBOL res 2768 800 R90
WINDOW 0 0 56 VBottom 0
WINDOW 3 32 56 VTop 0
SYMATTR InstName R65
SYMATTR Value 33k
SYMBOL res 2976 800 R90
WINDOW 0 0 56 VBottom 0
WINDOW 3 32 56 VTop 0
SYMATTR InstName R66
SYMATTR Value 33k
SYMBOL cap 2784 592 R90
WINDOW 0 0 32 VBottom 0
WINDOW 3 32 32 VTop 0
SYMATTR InstName C41
SYMATTR Value 0.001µ
SYMBOL cap 2608 976 R180
WINDOW 0 24 64 Left 0
WINDOW 3 24 8 Left 0
SYMATTR InstName C42
SYMATTR Value 0.1µ
SYMBOL cap 2848 976 R180
WINDOW 0 24 64 Left 0
WINDOW 3 24 8 Left 0
SYMATTR InstName C43
SYMATTR Value 0.047µ
SYMBOL res 2704 1040 R90
WINDOW 0 0 56 VBottom 0
WINDOW 3 32 56 VTop 0
SYMATTR InstName R67
SYMATTR Value 50k
SYMBOL res 2832 1040 R90
WINDOW 0 0 56 VBottom 0
WINDOW 3 32 56 VTop 0
SYMATTR InstName R68
SYMATTR Value 50k
SYMBOL res 3440 800 R90
WINDOW 0 0 56 VBottom 0
WINDOW 3 32 56 VTop 0
SYMATTR InstName R69
SYMATTR Value 100k
SYMBOL cap 3296 800 R90
WINDOW 0 0 32 VBottom 0
WINDOW 3 32 32 VTop 0
SYMATTR InstName C44
SYMATTR Value 0.22µ
SYMBOL res 3600 672 R90
WINDOW 0 0 56 VBottom 0
WINDOW 3 32 56 VTop 0
SYMATTR InstName R70
SYMATTR Value 100k
SYMBOL cap 3568 560 R90
WINDOW 0 0 32 VBottom 0
WINDOW 3 32 32 VTop 0
SYMATTR InstName C45
SYMATTR Value 1n
SYMBOL res 3696 848 R0
SYMATTR InstName R71
SYMATTR Value 500k
SYMBOL res 3696 992 R0
SYMATTR InstName R72
SYMATTR Value 500k
SYMBOL Opamps\\opamp2 3552 768 R0
SYMATTR InstName U14
SYMBOL res 3008 960 R0
SYMATTR InstName R73
SYMATTR Value 100k
SYMBOL Opamps\\opamp 3136 752 R0
SYMATTR InstName U15
SYMBOL cap 3040 928 R180
WINDOW 0 24 64 Left 0
WINDOW 3 24 8 Left 0
SYMATTR InstName C46
SYMATTR Value 0.22µ
SYMBOL cap 240 80 R90
WINDOW 0 0 32 VBottom 0
WINDOW 3 32 32 VTop 0
SYMATTR InstName C1
SYMATTR Value 1000µ
TEXT 32 504 Left 0 !.ac oct 25 1 1000000
TEXT 40 552 Left 0 !.inc opamp.sub
TEXT 496 480 Left 0 !;tran 0 0.02 0 0.00001
TEXT 952 328 Left 0 !.inc TL072.sub

The netlist it stands for:
* sMaster.asc
V1 N063 0 SINE(0 1 500) AC 1
R1 in vref 1000k
C2 N053 N052 100p
R2 N053 N052 30k
R3 N054 N053 70k
R4 N051 0 3.3k
C3 N052 N051 0.047µ
C4 N055 N054 0.068µ
R5 N042 N055 8.2k
R6 N043 N042 680k
C5 N043 N042 47p
R7 N056 N043 10k
C6 N057 N056 0.1µ
D1 N057 vref 1N914
D2 vref N057 1N914
C7 N059 N058 0.022µ
C8 N065 N064 0.22µ
C9 N069 N064 0.022µ
R8 N058 N064 6.8k
R9 N059 N062 1
R10 N062 N065 25k
R11 N065 N069 20k
R12 N069 vref 1k
R13 N046 N045 220k
R14 N045 N044 40k
C10 N044 vref 0.22µ
C11 N046 N045 0.0022µ
R15 N049 in 100
R16 N060 N049 33k
R17 N050 N060 33k
C12 N050 N049 0.001µ
C13 N067 N049 0.1µ
C14 N068 N060 0.047µ
R18 vref N067 50k
R19 N068 vref 50k
R20 N047 N061 100k
C15 N061 N050 0.22µ
R21 N048 N047 100k
C16 N048 N047 1n
R22 N048 N066 500k
R23 N066 0 500k
R24 N058 N057 1k
XU1 in N052 v+ 0 N053 opamp2  ; pins In+ In- V+ V- OUT
V2 v+ 0 9
XU2 vref N042 v+ 0 N043 opamp2  ; pins In+ In- V+ V- OUT
XU3 N062 N045 v+ 0 N046 opamp2  ; pins In+ In- V+ V- OUT
XU4 vref N047 v+ 0 N048 opamp2  ; pins In+ In- V+ V- OUT
V3 vref 0 4.5
R25 N034 N038 8.2k
R26 N035 N034 680k
XU5 vref N034 v+ 0 N035 opamp2  ; pins In+ In- V+ V- OUT
R27 N039 N035 10k
C17 N039 0 100p
C18 N025 in 0.01µ
R29 N025 vref 1000k
C19 N017 N016 100p
R§1k N017 N016 99k
R31 N018 N012 99k
R32 N015 0 3.3k
C20 N016 N015 0.047µ
C21 N003 N018 0.068µ
R33 N005 N003 8.2k
R34 N006 N005 680k
C22 N006 N005 47p
R35 NC_01 N006 10k
C23 N019 N004 0.1µ
D3 N019 vref 1N914
D4 vref N019 1N914
C24 N021 N020 0.022µ
C25 N027 N026 0.22µ
C26 N031 N026 0.022µ
R36 N020 N026 6.8k
R37 N021 N024 1
R38 N024 N027 25k
R39 N027 N031 50k
R40 N031 vref 1k
R41 N009 N008 220k
R42 N008 N007 40k
C27 N007 vref 0.22µ
C28 N009 N008 0.0022µ
R43 N013 N009 100
R44 N022 N013 33k
R45 N014 N022 33k
C29 N014 N013 0.001µ
C30 N029 N013 0.1µ
C31 N030 N022 0.047µ
R46 vref N029 1k
R47 N030 vref 99k
R48 N010 N023 100k
C32 N023 in 0.22µ
R49 N011 N010 100k
C33 N011 N010 1n
R50 N011 N028 500k
R51 N028 0 500k
R52 N020 N019 1k
XU6 N025 N016 v+ 0 N017 opamp2  ; pins In+ In- V+ V- OUT
XU7 vref N005 v+ 0 N006 opamp2  ; pins In+ In- V+ V- OUT
XU8 N024 N008 v+ 0 N009 opamp2  ; pins In+ In- V+ V- OUT
XU9 vref N010 v+ 0 N011 opamp2  ; pins In+ In- V+ V- OUT
R53 N001 N003 8.2k
R54 N002 N001 680k
XU10 vref N001 v+ 0 N002 opamp2  ; pins In+ In- V+ V- OUT
R55 N004 N002 10k
C34 N004 0 100p
R56 NC_02 0 8.2k
XU11 N012 N017 N012 opamp Aol=100K GBW=10Meg  ; pins invin noninvin out
R28 N032 in 100
R58 N036 N032 33k
R59 N033 N036 33k
C36 N033 N032 0.001µ
C37 N040 N032 0.1µ
C38 N041 N036 0.047µ
R60 0 N040 1k
R61 N041 0 99k
R62 0 N037 100k
C39 N037 N033 0.22µ
R64 N072 in 100
R65 N075 N072 33k
R66 N073 N075 33k
C41 N073 N072 0.001µ
C42 N079 N072 0.1µ
C43 N080 N075 0.047µ
R67 0 N079 50k
R68 N080 0 50k
R69 N070 N076 100k
C44 N076 in 0.22µ
R70 N071 N070 100k
C45 N071 N070 1n
R71 N071 N078 500k
R72 N078 0 500k
XU14 vref N070 v+ 0 N071 opamp2  ; pins In+ In- V+ V- OUT
R73 N077 0 100k
XU15 N074 N073 N074 opamp Aol=100K GBW=10Meg  ; pins invin noninvin out
C46 N077 N073 0.22µ
C1 in N063 1000µ
.model D D
.lib standard.dio
.ac oct 25 1 1000000
.inc opamp.sub
;tran 0 0.02 0 0.00001
.inc TL072.sub
.backanno
.end